# EAGLE design relay AZ832P2 THT (EAGLE 6.5.0)
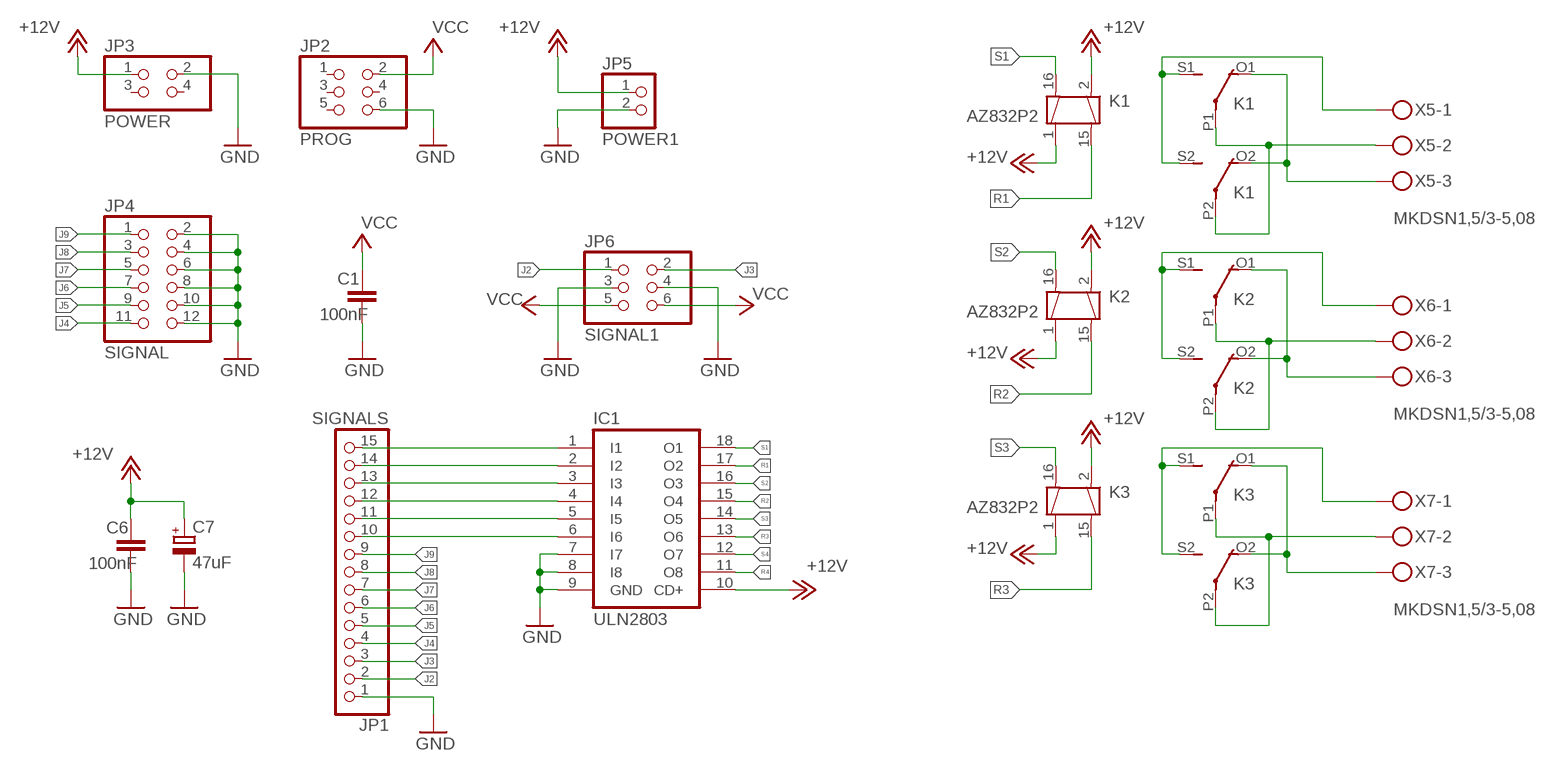
[diagram p0: schematic, sheet 1]

## Parts
C1  100nF  C-EU025-025X050  [C025-025X050]
C6  100nF  C-EU025-025X050  [C025-025X050]
C7  47uF  CPOL-EUE2.5-6  [E2,5-6]
IC1  ULN2803  ULN2803A  [DIL18]
JP1  SIGNALS  PINHD-1X15  [1X15]
JP2  PROG  PINHD-2X3  [2X03]
JP3  POWER  PINHD-2X2  [2X02]
JP4  SIGNAL  PINHD-2X6  [2X06]
JP5  POWER1  PINHD-1X2  [1X02]
JP6  SIGNAL1  PINHD-2X3  [2X03]
K1  AZ832P2  DS2-L2-24V  [DS2E-L2]
K2  AZ832P2  DS2-L2-24V  [DS2E-L2]
K3  AZ832P2  DS2-L2-24V  [DS2E-L2]
X5  MKDSN1,5/3-5,08  [MKDSN1,5/3-5,08]
X6  MKDSN1,5/3-5,08  [MKDSN1,5/3-5,08]
X7  MKDSN1,5/3-5,08  [MKDSN1,5/3-5,08]

## Nets
+12V: C6.1 C7.+ IC1.10(CD+) JP3.1 JP5.1 K1.1 K1.2 K2.1 K2.2 K3.1 K3.2
GND: C1.2 C6.2 C7.- IC1.7(I7) IC1.8(I8) IC1.9(GND) JP1.1 JP2.6 JP3.2 JP4.2 JP4.4 JP4.6 JP4.8 JP4.10 JP4.12 JP5.2 JP6.3 JP6.4
J2: JP1.2 JP6.1
J3: JP1.3 JP6.2
J4: JP1.4 JP4.11
J5: JP1.5 JP4.9
J6: JP1.6 JP4.7
J7: JP1.7 JP4.5
J8: JP1.8 JP4.3
J9: JP1.9 JP4.1
N$1: IC1.1(I1) JP1.15
N$2: IC1.2(I2) JP1.14
N$3: IC1.3(I3) JP1.13
N$4: IC1.4(I4) JP1.12
N$5: IC1.5(I5) JP1.11
N$6: IC1.6(I6) JP1.10
N$9: K1.S1(2:S) K1.S2(3:S) X5.1
N$10: K2.S1(2:S) K2.S2(3:S) X6.1
N$11: K3.S1(2:S) K3.S2(3:S) X7.1
N$13: K3.P1(2:P) K3.P2(3:P) X7.2
N$14: K2.P1(2:P) K2.P2(3:P) X6.2
N$15: K1.O1(2:O) K1.O2(3:O) X5.3
N$16: K2.O1(2:O) K2.O2(3:O) X6.3
N$18: K1.P1(2:P) K1.P2(3:P) X5.2
N$19: K3.O1(2:O) K3.O2(3:O) X7.3
R1: IC1.17(O2) K1.15
R2: IC1.15(O4) K2.15
R3: IC1.13(O6) K3.15
R4: IC1.11(O8)
S1: IC1.18(O1) K1.16
S2: IC1.16(O3) K2.16
S3: IC1.14(O5) K3.16
S4: IC1.12(O7)
VCC: C1.1 JP2.2 JP6.5 JP6.6
Unconnected: JP2.1 JP2.3 JP2.4 JP2.5 JP3.3 JP3.4

## Library data of the parts
C1 C6 = rcl:C-EU: CAPACITOR, European symbol
C7 = rcl:CPOL-EU: POLARIZED CAPACITOR, European symbol
IC1 = uln-udn:ULN2803A: DRIVER ARRAY
JP1 = pinhead:PINHD-1X15: PIN HEADER
JP2 JP6 = pinhead:PINHD-2X3: PIN HEADER
JP3 = pinhead:PINHD-2X2: PIN HEADER
JP4 = pinhead:PINHD-2X6: PIN HEADER
JP5 = pinhead:PINHD-1X2: PIN HEADER
K1-K3 = relay:DS2-L2-*: RELAY NAiS bistable, 2 x switch, 4 A/250 V; OC_FARNELL: unknown; OC_NEWARK: unknown
X5-X7 = con-phoenix-508:MKDSN1,5/3-5,08: MKDSN 1,5/ 3-5,08 Printklemme Nennstrom: 13,5 A Nennspannung: 250 V Rastermaß: 5,08 mm Polzahl: 3 Anschlussart: Schraubanschluss Montage: Löten Anschlussrichtung Leiter/Platine: 0 ° Artikelnummer: 1729131 Source: http://eshop.phoenixcontact.com .. 1729131.pdf; MPN: SMKDSN1,5/3-5,08; OC_FARNELL: 1792904; OC_NEWARK: 70R0299

## Board
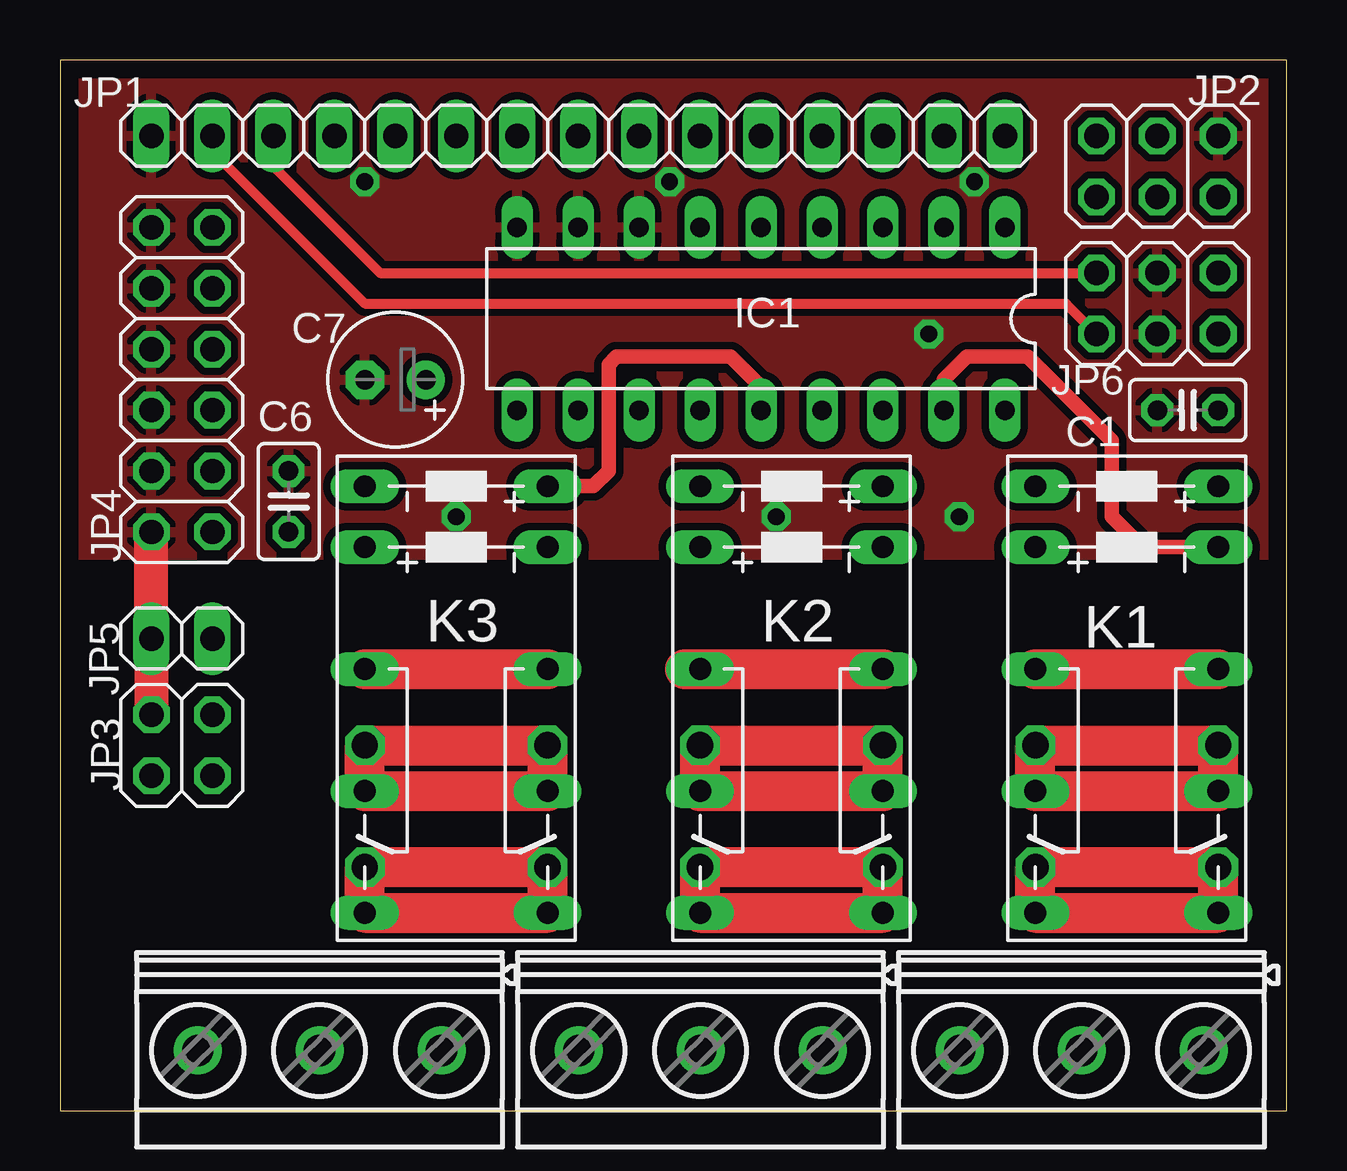
[diagram p1: board, top side]
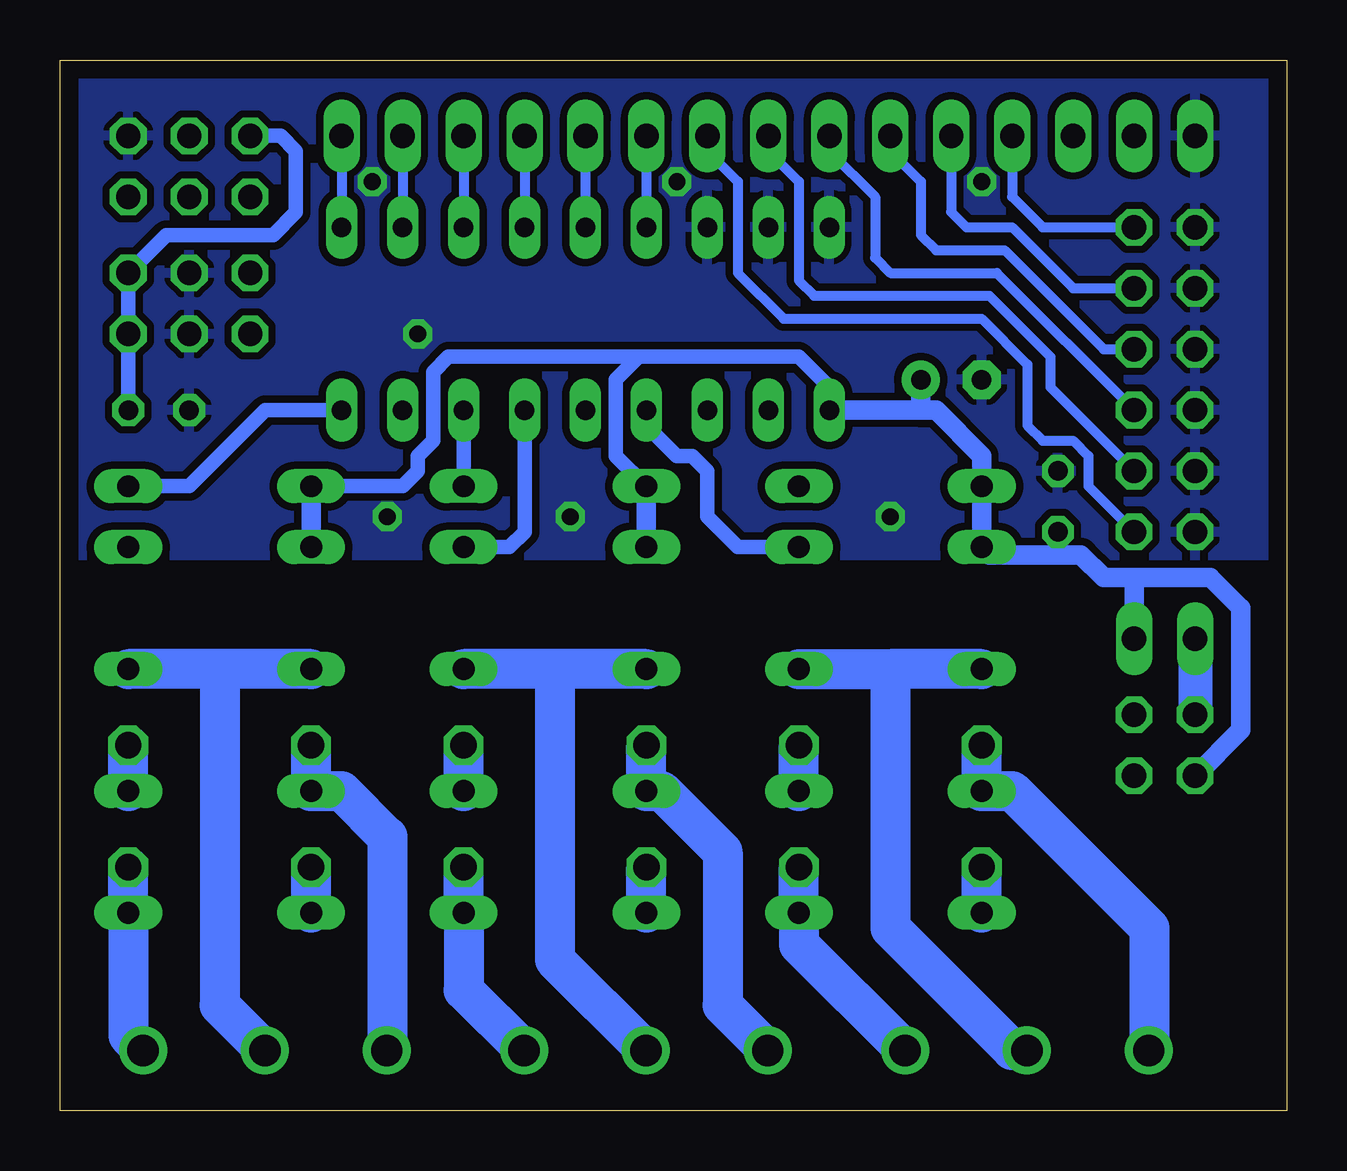
[diagram p2: board, bottom side, seen from below]

Size 51.1 x 43.8 mm. Coordinates in mm from the lower left corner, seen from the top.
Outline: 0,0 51.1,0 51.1,43.8 0,43.8 0,0
Copper layers (1*16): Top 0.035mm / dielectric 1.5mm / Bottom 0.035mm
Design rules: minimum track width 12mil, minimum drill 24mil, track to track 12mil, track to pad 12mil, pad to pad 12mil, via to via 12mil, smd to smd 8mil, copper to edge 30mil, drill to drill 12mil, minimum pad ring 10mil, minimum via ring 10mil, stop-mask expansion 4mil, vias tented up to drill 0mil, thermal gap 10mil

### Footprints (pad centres in the part's own frame; a part is rotated, then mirrored left to right if it is on the bottom)
C025-025X050 = drill 0.813 octagon: 1 -1.27,0; 2 1.27,0
E2,5-6 = drill 0.813 pad 1.6: + -1.27,0 | drill 0.813 pad 1.6 octagon: - 1.27,0
DIL18 = drill 0.813 long: 1 -10.16,-3.81; 2 -7.62,-3.81; 3 -5.08,-3.81; 4 -2.54,-3.81; 5 0,-3.81; 6 2.54,-3.81; 7 5.08,-3.81; 8 7.62,-3.81; 9 10.16,-3.81; 10 10.16,3.81; 11 7.62,3.81; 12 5.08,3.81; 13 2.54,3.81; 14 0,3.81; 15 -2.54,3.81; 16 -5.08,3.81; 17 -7.62,3.81; 18 -10.16,3.81
1X15 = drill 1.016 long: 1 -17.78,0; 2 -15.24,0; 3 -12.7,0; 4 -10.16,0; 5 -7.62,0; 6 -5.08,0; 7 -2.54,0; 8 0,0; 9 2.54,0; 10 5.08,0; 11 7.62,0; 12 10.16,0; 13 12.7,0; 14 15.24,0; 15 17.78,0
2X03 = drill 1.016 octagon: 1 -2.54,-1.27; 2 -2.54,1.27; 3 0,-1.27; 4 0,1.27; 5 2.54,-1.27; 6 2.54,1.27
2X02 = drill 1.016 octagon: 1 -1.27,-1.27; 2 -1.27,1.27; 3 1.27,-1.27; 4 1.27,1.27
2X06 = drill 1.016 octagon: 1 -6.35,-1.27; 2 -6.35,1.27; 3 -3.81,-1.27; 4 -3.81,1.27; 5 -1.27,-1.27; 6 -1.27,1.27; 7 1.27,-1.27; 8 1.27,1.27; 9 3.81,-1.27; 10 3.81,1.27; 11 6.35,-1.27; 12 6.35,1.27
1X02 = drill 1.016 long: 1 -1.27,0; 2 1.27,0
DS2E-L2 = drill 0.914 long: 1 -7.62,-3.81; 2 -5.08,-3.81; 15 -5.08,3.81; 16 -7.62,3.81; O1 5.08,-3.81; O2 5.08,3.81; P1 0,-3.81; P2 0,3.81; S1 10.16,-3.81; S2 10.16,3.81
MKDSN1,5/3-5,08 = drill 1.3 pad 2: 1 -7.641,0.025; 2 -2.561,0.025; 3 2.519,0.025

### Placement (x,y rotation side)
C1  46.99,29.21 180 top
C6  9.53,25.4 90 top
C7  13.97,30.48 180 top
IC1  29.21,33.02 180 top
JP1  21.59,40.64 0 top
JP2  45.72,39.37 0 top
JP3  5.08,15.24 0 top
JP4  5.08,30.48 90 top
JP5  5.08,19.68 180 top
JP6  45.72,33.66 0 top
K1  44.45,18.41 270 top
K2  30.48,18.41 270 top
K3  16.51,18.41 270 top
X5  40.01,2.54 180 top
X6  24.13,2.54 180 top
X7  8.26,2.54 180 top

### Tracks (layer width: path | path; a pad name or v marks a point on that pad's centre or on a via)
+12V
  Bottom 0.61: IC1.10 19.05,30.16 20.32,31.43 26.99,31.43 | 26.99,31.43 27.94,30.48 27.94,27.3 K2.1 | K1.1 36.83,26.04 36.2,26.67 36.2,27.3 35.56,27.94 35.56,30.8 34.92,31.43 26.99,31.43
  Bottom 0.813: JP3.1 1.91,15.88 1.91,20.95 3.17,22.23 6.35,22.23 | K2.2 K2.1 | K1.2 K1.1 | JP5.1 6.35,22.23 | 15.24,29.21 14.61,29.21 12.7,27.3 K3.1 K3.2 12.38,23.18 9.53,23.18 | 15.24,29.21 IC1.10 | C7.+ 15.24,29.21 | 6.35,22.23 7.62,22.23 8.57,23.18 9.53,23.18 | C6.1 9.53,23.18
GND  (via drill 0.7)
  Top 1.422: JP4.2 JP5.2 JP3.2
  Bottom 1.422: JP5.2 JP3.2
  other vias: 16.51,24.77 29.84,24.77 37.47,24.77 12.7,38.73 36.2,32.38 25.4,38.73 38.1,38.73
  pour Bottom (isolate 0.305): -1.27,44.45 51.44,44.45 51.44,23.18 -1.27,23.18
  pour Top (isolate 0.305): -1.27,44.45 51.44,44.45 51.44,23.18 -1.27,23.18
J2
  Top 0.406: JP1.2 6.35,40.01 12.7,33.66 41.91,33.66 JP6.1
J3
  Top 0.406: JP6.2 13.34,34.92 8.89,39.37 JP1.3
J4
  Bottom 0.406: JP1.4 11.43,38.1 10.16,36.83 JP4.11
J5
  Bottom 0.406: JP1.5 13.97,37.47 13.34,36.83 11.43,36.83 8.89,34.29 JP4.9
J6
  Bottom 0.406: JP1.6 16.51,40.01 15.24,38.73 15.24,36.51 14.61,35.88 11.75,35.88 7.62,31.75 JP4.7
J7
  Bottom 0.406: JP1.7 19.05,40.01 17.14,38.1 17.14,35.56 16.51,34.92 12.06,34.92 JP4.5
J8
  Bottom 0.406: JP1.8 21.59,40.01 20.32,38.73 20.32,34.61 19.68,33.97 12.38,33.97 9.84,31.43 9.84,30.16 JP4.3
J9
  Bottom 0.406: JP1.9 24.13,40.01 22.86,38.73 22.86,34.92 20.95,33.02 12.7,33.02 10.79,31.11 10.79,28.57 10.16,27.94 8.89,27.94 8.26,27.3 8.26,26.04 JP4.1
N$1
  Bottom 0.406: JP1.15 IC1.1
N$2
  Bottom 0.406: JP1.14 IC1.2
N$3
  Bottom 0.406: JP1.13 IC1.3
N$4
  Bottom 0.406: JP1.12 IC1.4
N$5
  Bottom 0.406: JP1.11 IC1.5
N$6
  Bottom 0.406: JP1.10 IC1.6
N$9  (via drill 1.1)
  Top 1.676: K1.S1 K1.S2 v48.26,10.16 v40.64,10.16 K1.S1
  Bottom 1.676: X5.1 48.26,3.13 K1.S2 v48.26,10.16 | K1.S1 v40.64,10.16
N$10  (via drill 1.1)
  Top 1.676: K2.S1 K2.S2 v34.29,10.16 v26.67,10.16 K2.S1
  Bottom 1.676: X6.1 34.29,5.03 K2.S2 v34.29,10.16 | K2.S1 v26.67,10.16
N$11  (via drill 1.1)
  Top 1.676: K3.S1 K3.S2 v20.32,10.16 v12.7,10.16 K3.S1
  Bottom 1.676: X7.1 20.32,6.94 K3.S2 v20.32,10.16 | K3.S1 v12.7,10.16
N$13
  Top 1.676: K3.P1 K3.P2
  Bottom 1.27: 11.43,2.54 10.84,2.54
  Bottom 1.676: K3.P2 16.51,18.41 | K3.P1 16.51,18.41 | 16.51,18.41 16.51,7.62 11.43,2.54 | 10.84,2.54 X7.2
N$14
  Top 1.676: 26.04,18.41 K2.P2
  Bottom 1.676: 30.48,18.41 K2.P2 | K2.P1 30.48,18.41 | 30.48,18.41 30.48,6.3 X6.2
N$15  (via drill 1.1)
  Top 1.676: K1.O1 K1.O2 v48.26,15.24 v40.64,15.24 K1.O1
  Bottom 1.27: 37.47,2.54 X5.3
  Bottom 1.676: 37.47,2.54 37.47,11.43 39.37,13.34 K1.O1 v40.64,15.24 | K1.O2 v48.26,15.24
N$16  (via drill 1.1)
  Top 1.676: K2.O1 K2.O2 v34.29,15.24 v26.67,15.24 K2.O1
  Bottom 1.676: X6.3 23.5,4.4 23.5,10.79 26.04,13.34 K2.O1 v26.67,15.24 | K2.O2 v34.29,15.24
N$18
  Top 1.676: K1.P1 K1.P2
  Bottom 1.676: 44.45,18.41 K1.P2 | K1.P1 44.45,18.41 | 44.45,18.41 44.45,4.4 X5.2
N$19  (via drill 1.1)
  Top 1.676: K3.O1 K3.O2 v20.32,15.24 v12.7,15.24 K3.O1
  Bottom 1.676: v12.7,15.24 K3.O1 11.43,13.34 5.71,7.62 5.71,2.54 X7.3 | K3.O2 v20.32,15.24
R1
  Top 0.61: IC1.17 36.83,30.48 37.78,31.43 40.32,31.43 43.81,27.94 43.81,24.77 45.09,23.5 K1.15
R2
  Bottom 0.61: IC1.15 31.75,24.13 32.38,23.5 K2.15
R3
  Bottom 0.61: IC1.13 26.67,28.57 25.4,27.3 24.77,27.3 24.13,26.67 24.13,24.77 22.86,23.5 K3.15
S1
  Bottom 0.61: IC1.18 42.55,29.21 45.72,26.04 K1.16
S2
  Bottom 0.61: IC1.16 K2.16
S3
  Top 0.61: IC1.14 29.21,30.16 27.94,31.43 23.18,31.43 22.86,31.11 22.86,26.67 22.23,26.04 K3.16
VCC
  Bottom 0.61: C1.1 JP6.5 JP6.6 46.67,36.51 42.23,36.51 41.27,37.47 41.27,40.01 41.91,40.64 JP2.2